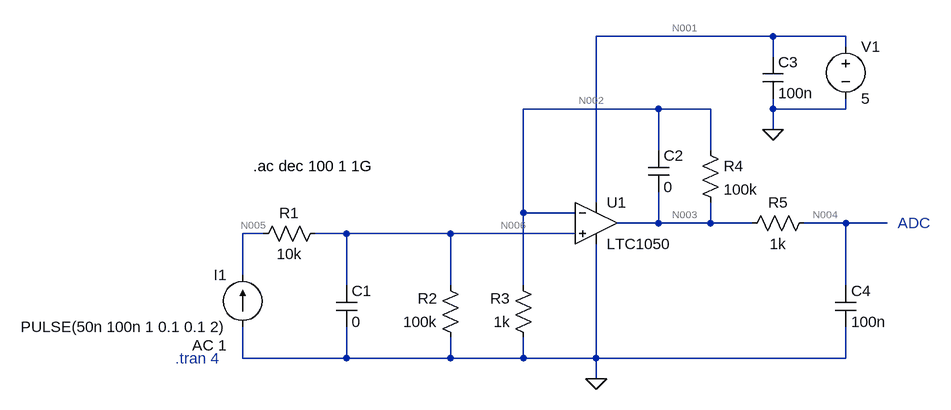
[diagram p0: schematic AIME_1.asc]
AIME_1.asc, the LTspice schematic file:
Version 4.1
SHEET 1 984 680
WIRE 720 -224 448 -224
WIRE 832 -224 720 -224
WIRE 832 -208 832 -224
WIRE 720 -192 720 -224
WIRE 544 -112 336 -112
WIRE 624 -112 544 -112
WIRE 720 -112 720 -128
WIRE 832 -112 832 -128
WIRE 832 -112 720 -112
WIRE 720 -80 720 -112
WIRE 544 -48 544 -112
WIRE 624 -48 624 -112
WIRE 448 32 448 -224
WIRE 336 48 336 -112
WIRE 416 48 336 48
WIRE 544 64 544 16
WIRE 544 64 480 64
WIRE 624 64 624 32
WIRE 624 64 544 64
WIRE 688 64 624 64
WIRE 832 64 768 64
WIRE 896 64 832 64
WIRE -64 80 -96 80
WIRE 64 80 16 80
WIRE 224 80 64 80
WIRE 416 80 224 80
WIRE -96 144 -96 80
WIRE 64 160 64 80
WIRE 224 160 224 80
WIRE 336 160 336 48
WIRE 832 160 832 64
WIRE -96 272 -96 224
WIRE 64 272 64 224
WIRE 64 272 -96 272
WIRE 224 272 224 240
WIRE 224 272 64 272
WIRE 336 272 336 240
WIRE 336 272 224 272
WIRE 448 272 448 96
WIRE 448 272 336 272
WIRE 832 272 832 224
WIRE 832 272 448 272
WIRE 448 304 448 272
FLAG 448 304 0
FLAG 720 -80 0
SYMBOL OpAmps\\LTC1050 448 0 R0
SYMATTR InstName U1
SYMBOL res 32 64 R90
WINDOW 0 0 56 VBottom 2
WINDOW 3 32 56 VTop 2
SYMATTR InstName R1
SYMATTR Value 10k
SYMBOL res 240 256 R180
WINDOW 0 36 76 Left 2
WINDOW 3 36 40 Left 2
SYMATTR InstName R2
SYMATTR Value 100k
SYMBOL res 352 256 R180
WINDOW 0 36 76 Left 2
WINDOW 3 36 40 Left 2
SYMATTR InstName R3
SYMATTR Value 1k
SYMBOL cap 48 160 R0
SYMATTR InstName C1
SYMATTR Value 0
SYMBOL current -96 224 R180
WINDOW 0 24 80 Left 2
WINDOW 3 24 0 Left 2
WINDOW 123 24 -28 Left 2
WINDOW 39 0 0 Left 0
SYMATTR InstName I1
SYMATTR Value PULSE(50n 100n 1 0.1 0.1 2)
SYMATTR Value2 AC 1
SYMBOL cap 528 -48 R0
SYMATTR InstName C2
SYMATTR Value 0
SYMBOL res 608 -64 R0
SYMATTR InstName R4
SYMATTR Value 100k
SYMBOL voltage 832 -224 R0
WINDOW 123 0 0 Left 0
WINDOW 39 0 0 Left 0
SYMATTR InstName V1
SYMATTR Value 5
SYMBOL cap 704 -192 R0
SYMATTR InstName C3
SYMATTR Value 100n
SYMBOL res 784 48 R90
WINDOW 0 0 56 VBottom 2
WINDOW 3 32 56 VTop 2
SYMATTR InstName R5
SYMATTR Value 1k
SYMBOL cap 816 160 R0
SYMATTR InstName C4
SYMATTR Value 100n
TEXT 912 64 Left 2 ;ADC
TEXT -200 272 Left 2 ;.tran 4
TEXT -80 -24 Left 2 !.ac dec 100 1 1G

The netlist it stands for:
* AIME_1.asc
X§U1 N006 N002 N001 0 N003 LTC1050  ; pins In+ In- V+ V- OUT
R1 N006 N005 10k
R2 0 N006 100k
R3 0 N002 1k
C1 N006 0 0
I1 0 N005 PULSE(50n 100n 1 0.1 0.1 2) AC 1
C2 N002 N003 0
R4 N002 N003 100k
V1 N001 0 5
C3 N001 0 100n
R5 N004 N003 1k
C4 N004 0 100n
* ADC
* .tran 4
.ac dec 100 1 1G
.lib LTC.lib
.backanno
.end

* Results of the author's LTspice run, read from the files saved beside the schematic
* Operating Point, zero values left out:
*   V(n001) = 5 V
*   V(n002) = 5 mV
*   V(n003) = 505 mV
*   V(n004) = 505 mV
*   V(n005) = 5.5 mV
*   V(n006) = 5 mV
*   I(I1) = 50 nA
*   I(R1) = -50 nA
*   I(R2) = -50 nA
*   I(R3) = -5 µA
*   I(R4) = -5 µA
*   I(V1) = -754.1 µA
*   Ix(u1:3) = 754.1 µA
*   Ix(u1:4) = -749.1 µA
*   Ix(u1:5) = -5 µA
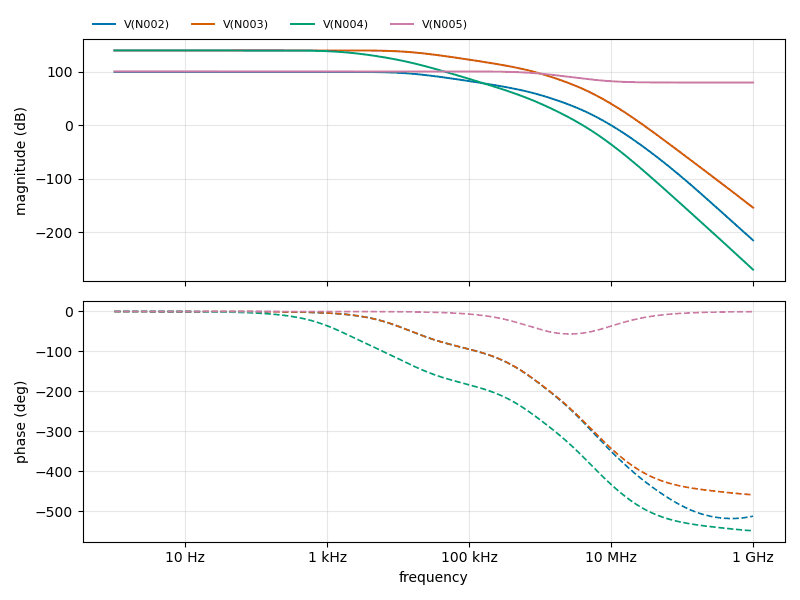
[diagram p1: AC Analysis of AIME_1.asc, plotted from the saved traces]
* AC Analysis, 1 run:
*   V(N002): 100.00 dB at 1 Hz, -214.75 dB at 1 GHz, peak 100.03 dB at 1.318 kHz, 3 dB below the peak at 14.16 kHz
*   V(N003): 140.09 dB at 1 Hz, -153.75 dB at 1 GHz, peak 140.11 dB at 1.318 kHz, 3 dB below the peak at 14.16 kHz
*   V(N004): 140.09 dB at 1 Hz, -269.72 dB at 1 GHz, peak 140.09 dB at 1 Hz, 3 dB below the peak at 1.6 kHz
*   V(N005): 100.83 dB at 1 Hz, 80.04 dB at 1 GHz, peak 100.83 dB at 1 Hz, 3 dB below the peak at 802.1 kHz